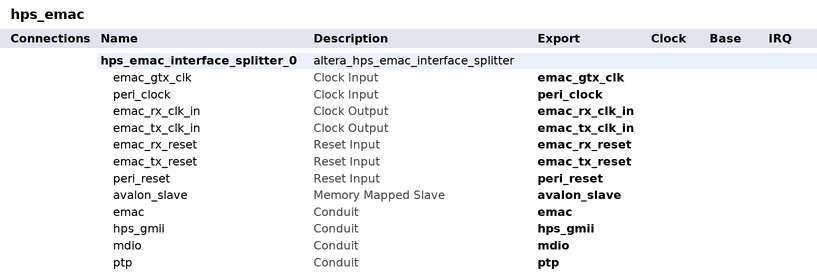
[diagram p0: system contents]
# Platform Designer (Qsys) system hps_emac, Cyclone V 5CSEBA6U23I7
# Parameters at their usual value, and those the tool derives, are not listed.
package require -exact qsys 17.0
create_system hps_emac
set_project_property DEVICE_FAMILY {Cyclone V}
set_project_property DEVICE 5CSEBA6U23I7

add_instance hps_emac_interface_splitter_0 altera_hps_emac_interface_splitter 17.0
set_instance_property hps_emac_interface_splitter_0 AUTO_EXPORT true

# exported interfaces
add_interface avalon_slave avalon slave
set_interface_property avalon_slave EXPORT_OF hps_emac_interface_splitter_0.avalon_slave
add_interface emac conduit end
set_interface_property emac EXPORT_OF hps_emac_interface_splitter_0.emac
add_interface emac_gtx_clk clock sink
set_interface_property emac_gtx_clk EXPORT_OF hps_emac_interface_splitter_0.emac_gtx_clk
add_interface emac_rx_clk_in clock source
set_interface_property emac_rx_clk_in EXPORT_OF hps_emac_interface_splitter_0.emac_rx_clk_in
add_interface emac_rx_reset reset sink
set_interface_property emac_rx_reset EXPORT_OF hps_emac_interface_splitter_0.emac_rx_reset
add_interface emac_tx_clk_in clock source
set_interface_property emac_tx_clk_in EXPORT_OF hps_emac_interface_splitter_0.emac_tx_clk_in
add_interface emac_tx_reset reset sink
set_interface_property emac_tx_reset EXPORT_OF hps_emac_interface_splitter_0.emac_tx_reset
add_interface hps_gmii conduit end
set_interface_property hps_gmii EXPORT_OF hps_emac_interface_splitter_0.hps_gmii
add_interface mdio conduit end
set_interface_property mdio EXPORT_OF hps_emac_interface_splitter_0.mdio
add_interface peri_clock clock sink
set_interface_property peri_clock EXPORT_OF hps_emac_interface_splitter_0.peri_clock
add_interface peri_reset reset sink
set_interface_property peri_reset EXPORT_OF hps_emac_interface_splitter_0.peri_reset
add_interface ptp conduit end
set_interface_property ptp EXPORT_OF hps_emac_interface_splitter_0.ptp

set_interconnect_requirement {$system} qsys_mm.clockCrossingAdapter HANDSHAKE
set_interconnect_requirement {$system} qsys_mm.enableEccProtection FALSE
set_interconnect_requirement {$system} qsys_mm.insertDefaultSlave FALSE
set_interconnect_requirement {$system} qsys_mm.maxAdditionalLatency 1

save_system hps_emac.qsys
